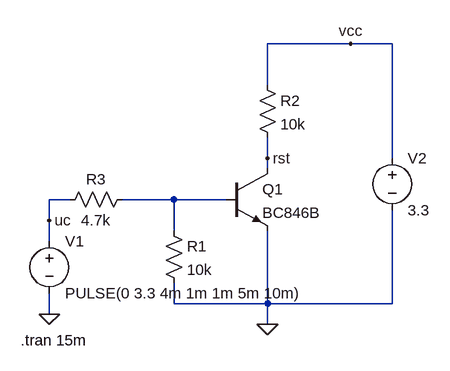
[diagram p0: schematic bc546_pull-down.asc]
bc546_pull-down.asc, the LTspice schematic file:
Version 4
SHEET 1 880 680
WIRE 288 -80 160 -80
WIRE 352 -80 288 -80
WIRE 160 -16 160 -80
WIRE 160 96 160 64
WIRE 352 96 352 -80
WIRE 160 112 160 96
WIRE -144 160 -176 160
WIRE 16 160 -64 160
WIRE 96 160 16 160
WIRE -176 192 -176 160
WIRE 16 208 16 160
WIRE -176 224 -176 192
WIRE 16 320 16 288
WIRE 160 320 160 208
WIRE 160 320 16 320
WIRE 352 320 352 176
WIRE 352 320 160 320
WIRE -176 336 -176 304
WIRE 160 352 160 320
FLAG 160 352 0
FLAG -176 336 0
FLAG 160 96 rst
FLAG 288 -80 vcc
FLAG -176 192 uc
SYMBOL npn 96 112 R0
SYMATTR InstName Q1
SYMATTR Value BC846B
SYMBOL res 0 192 R0
SYMATTR InstName R1
SYMATTR Value 10k
SYMBOL res 144 -32 R0
SYMATTR InstName R2
SYMATTR Value 10k
SYMBOL res -48 144 R90
WINDOW 0 0 56 VBottom 2
WINDOW 3 32 56 VTop 2
SYMATTR InstName R3
SYMATTR Value 4.7k
SYMBOL voltage -176 208 R0
WINDOW 123 0 0 Left 0
WINDOW 39 0 0 Left 0
SYMATTR InstName V1
SYMATTR Value PULSE(0 3.3 4m 1m 1m 5m 10m)
SYMBOL voltage 352 80 R0
WINDOW 123 0 0 Left 0
WINDOW 39 0 0 Left 0
SYMATTR InstName V2
SYMATTR Value 3.3
TEXT -220 376 Left 2 !.tran 15m

The netlist it stands for:
* bc546_pull-down.asc
Q1 rst N001 0 0 BC846B
R1 N001 0 10k
R2 vcc rst 10k
R3 N001 uc 4.7k
V1 uc 0 PULSE(0 3.3 4m 1m 1m 5m 10m)
V2 vcc 0 3.3
.model NPN NPN
.model PNP PNP
.lib standard.bjt
.tran 15m
.backanno
.end

* Results of the author's LTspice run, read from the files saved beside the schematic
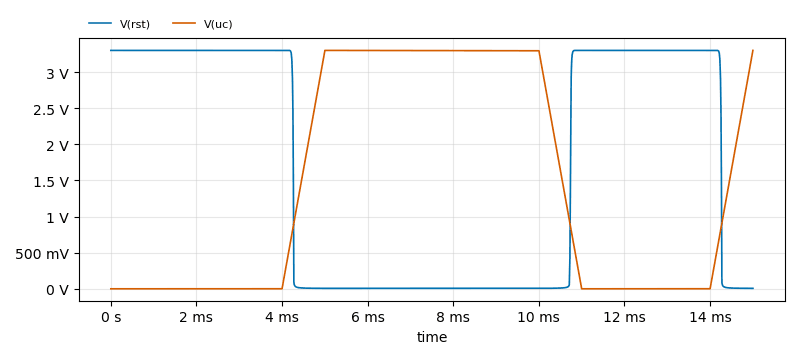
[diagram p1: Transient Analysis of bc546_pull-down.asc, plotted from the saved traces]
* Transient Analysis, 1 run:
*   V(rst): min 6.413 mV, max 3.301 V, average 1.715 V, rms 2.373 V, last 6.418 mV
*   V(uc): min 0 V, max 3.3 V, average 1.429 V, rms 2.086 V, last 3.3 V